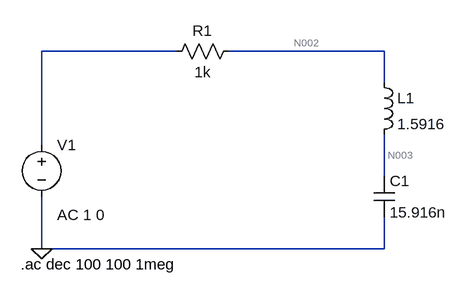
[diagram p0: schematic Draft1.asc]
Draft1.asc, the LTspice schematic file:
Version 4.1
SHEET 1 880 680
WIRE 176 -16 -32 -16
WIRE 496 -16 256 -16
WIRE 496 32 496 -16
WIRE -32 128 -32 -16
WIRE 496 176 496 112
WIRE -32 288 -32 208
WIRE 496 288 496 240
WIRE 496 288 -32 288
FLAG -32 288 0
SYMBOL voltage -32 112 R0
WINDOW 123 24 124 Left 2
WINDOW 39 0 0 Left 0
SYMATTR InstName V1
SYMATTR Value ""
SYMATTR Value2 AC 1 0
SYMBOL res 272 -32 R90
WINDOW 0 0 56 VBottom 2
WINDOW 3 32 56 VTop 2
SYMATTR InstName R1
SYMATTR Value 1k
SYMBOL ind 480 16 R0
SYMATTR InstName L1
SYMATTR Value 1.5916
SYMATTR SpiceLine Rser=1m
SYMBOL cap 480 176 R0
SYMATTR InstName C1
SYMATTR Value 15.916n
TEXT -64 312 Left 2 !.ac dec 100 100 1meg

The netlist it stands for:
* Draft1.asc
V1 N001 0 AC 1 0
R1 N002 N001 1k
L1 N002 N003 1.5916 Rser=1m
C1 N003 0 15.916n
.ac dec 100 100 1meg
.backanno
.end

* Results of the author's LTspice run, read from the files saved beside the schematic
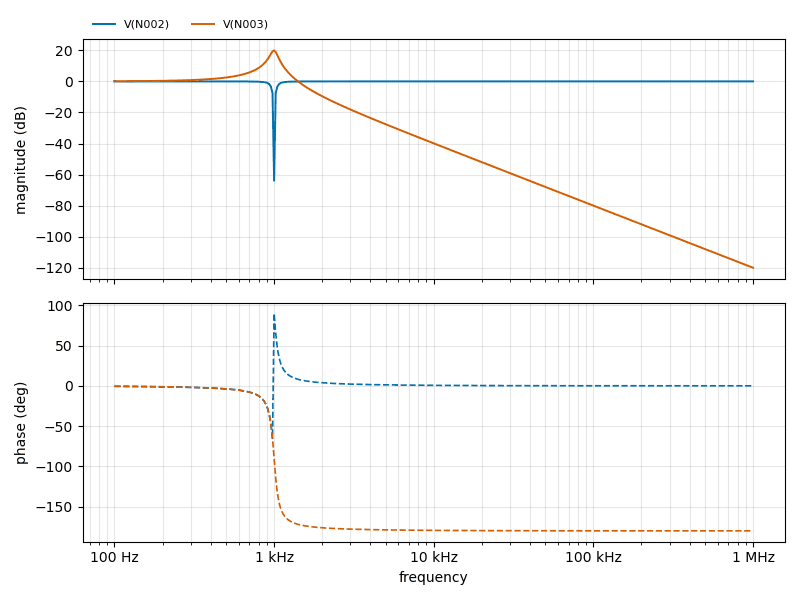
[diagram p1: AC Analysis of Draft1.asc, plotted from the saved traces]
* AC Analysis, 1 run:
*   V(N002): -0.00 dB at 100 Hz, -0.00 dB at 1 MHz, peak -0.00 dB at 1 MHz, 3 dB below the peak at 1.053 kHz
*   V(N003): 0.09 dB at 100 Hz, -120.00 dB at 1 MHz, peak 20.00 dB at 1 kHz, 3 dB below the peak at 945.8 Hz and 1.046 kHz